# EAGLE design res15_nrf905 (EAGLE 7.2.0)
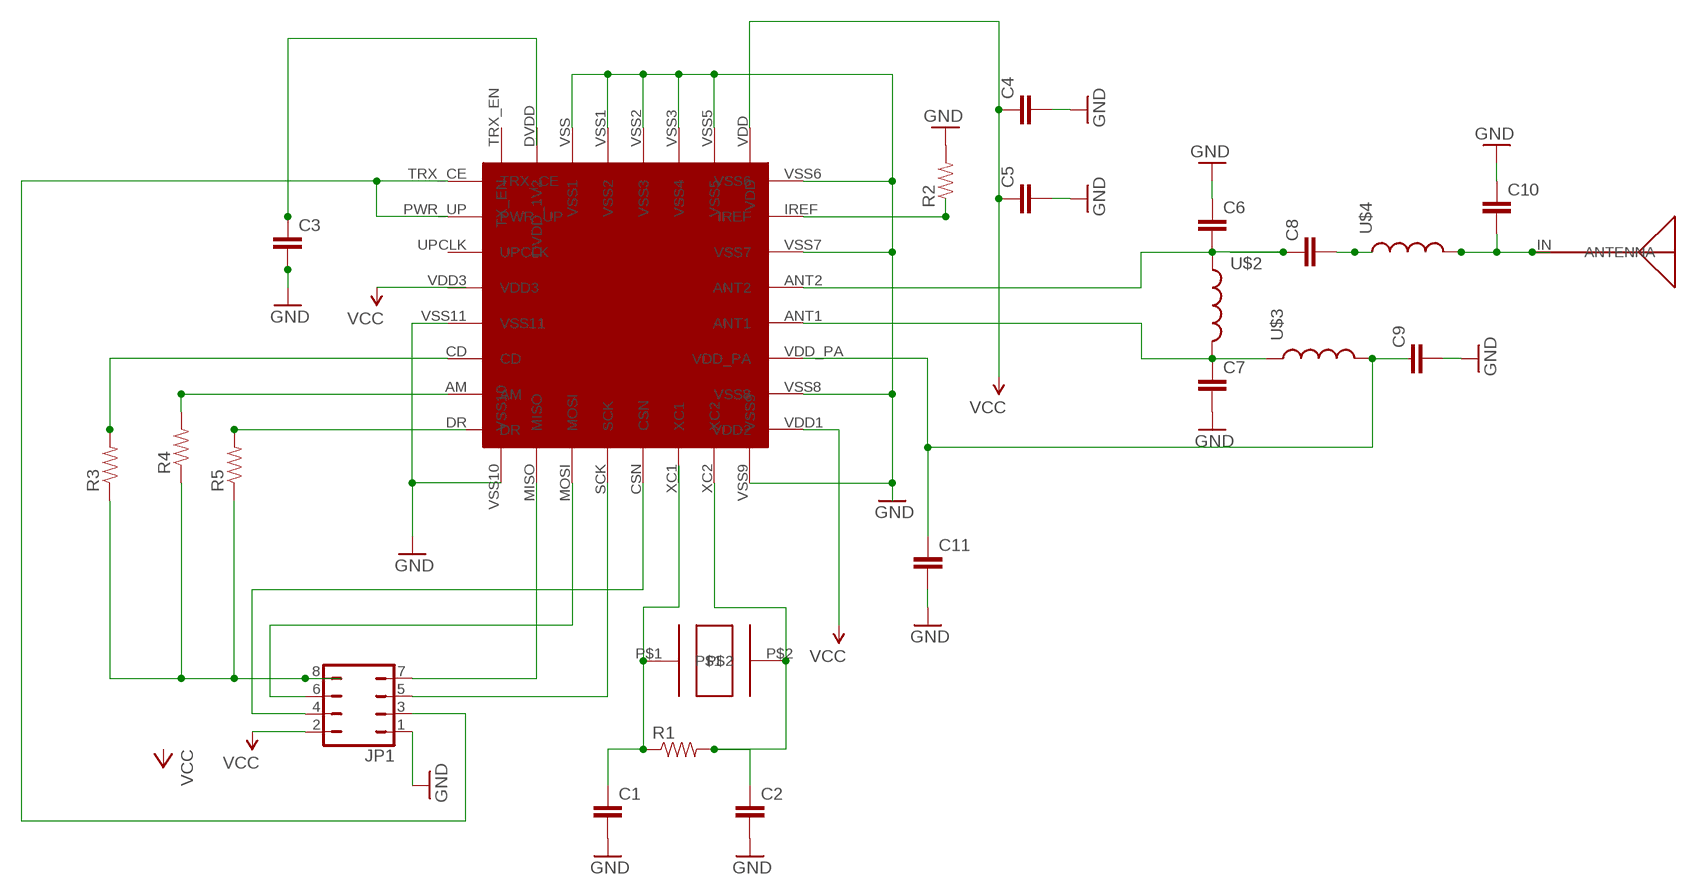
[diagram p0: schematic, sheet 1]

## Parts
C1  CAP0402-CAP  [0402-CAP]
C2  CAP0402-CAP  [0402-CAP]
C3  CAP0402-CAP  [0402-CAP]
C4  CAP0402-CAP  [0402-CAP]
C5  CAP0402-CAP  [0402-CAP]
C6  CAP0402-CAP  [0402-CAP]
C7  CAP0402-CAP  [0402-CAP]
C8  CAP0402-CAP  [0402-CAP]
C9  CAP0402-CAP  [0402-CAP]
C10  CAP0402-CAP  [0402-CAP]
C11  CAP0402-CAP  [0402-CAP]
JP1  JP4Q  [JP4Q]
R1  RESISTOR0402-RES  [0402-RES]
R2  RESISTOR0603-RES  [0603-RES]
R3  RESISTOR0603-RES  [0603-RES]
R4  RESISTOR0603-RES  [0603-RES]
R5  RESISTOR0603-RES  [0603-RES]
U$1  NRF905  [NRF905]
U$2  INDUCTOR0603  [0603]
U$3  INDUCTOR0603  [0603]
U$4  INDUCTOR0603  [0603]
U$5  WURTH-7488910092  [WURTH-7488910092]
U$6  HC46X  [HC46X]

## Nets
GND: C1.2 C2.2 C3.2 C4.2 C5.2 C6.1 C7.2 C9.2 C10.1 C11.2 JP1.1 R2.2 U$1.VSS1(VSS2) U$1.VSS2(VSS3) U$1.VSS3(VSS4) U$1.VSS5 U$1.VSS6 U$1.VSS7 U$1.VSS8 U$1.VSS9 U$1.VSS10 U$1.VSS11 U$1.VSS(VSS1)
N$1: C1.1 R1.1 U$6.P$1
N$2: C2.1 R1.2 U$1.XC2 U$6.P$2
N$3: C7.1 U$1.ANT1 U$2.2 U$3.1
N$4: JP1.7 U$1.MISO
N$5: JP1.6 U$1.MOSI
N$6: C3.1
N$7: JP1.5 U$1.SCK
N$9: C11.1 U$1.VDD_PA U$3.2
N$10: C6.2 C8.1 U$1.ANT2 U$2.1
N$11: C8.2 U$4.1
N$12: C10.2 U$4.2 U$5.IN(ANTENNA)
N$13: JP1.4 U$1.CSN
N$14: R2.1 U$1.IREF
N$15: JP1.3 U$1.PWR_UP U$1.TRX_CE
N$16: R3.2 U$1.CD
N$17: JP1.8 R3.1 R4.1 R5.1
N$18: R4.2 U$1.AM
N$19: R5.2
VCC: C4.1 C5.1 JP1.2 U$1.VDD U$1.VDD1(VDD2)
Unconnected: C9.1 U$1.DVDD(DVDD_1V2) U$1.TRX_EN(TX_EN) U$1.UPCLK U$1.XC1

## Power pins joined to a net without a drawn wire
DR: U$1.DR
VDD3: U$1.VDD3

## Library data of the parts
C1-C11 = SparkFun:CAP: Capacitor Standard 0603 ceramic capacitor, and 0.1" leaded capacitor.
JP1 = jumper:JP4Q: JUMPER
R1-R5 = SparkFun:RESISTOR: Resistor Basic schematic elements and footprints for 0603, 1206, and PTH 1/10th watt (small) resistors.
U$1 = nrf905:NRF905
U$2-U$4 = SparkFun:INDUCTOR: Inductors Basic Inductor/Choke - 0603 and 1206. Footprints are not proven and vary greatly between part numbers.
U$5 = nrf905:WURTH-7488910092
U$6 = nrf905:HC46X

## Board
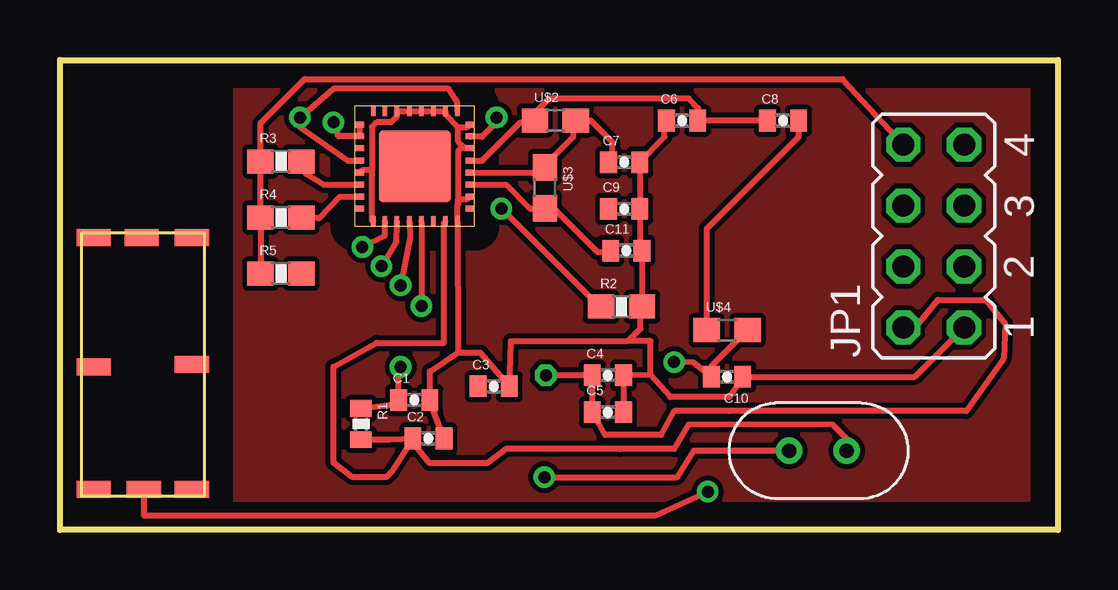
[diagram p1: board, top side]
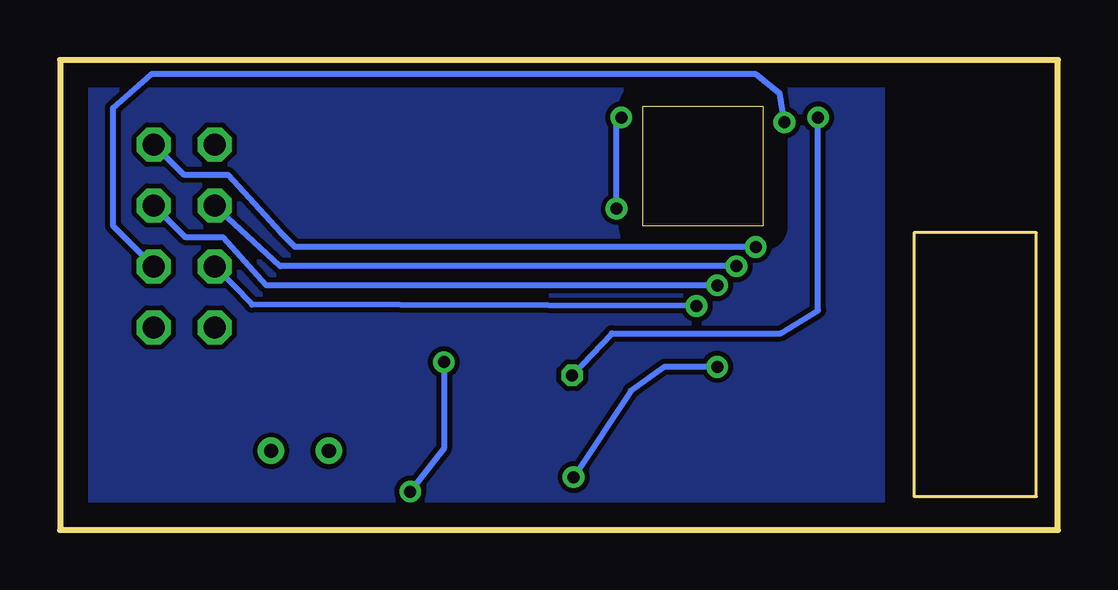
[diagram p2: board, bottom side, seen from below]

Size 41.6 x 19.6 mm. Coordinates in mm from the lower left corner, seen from the top.
Outline: 0,19.6 41.6,19.6 41.6,0 0,0 0,19.6
Copper layers (1*16): Top 0.035mm / dielectric 1.5mm / Bottom 0.035mm
Design rules "default": minimum track width 10mil, minimum drill 24mil, track to track 8mil, track to pad 8mil, pad to pad 8mil, via to via 8mil, smd to smd 8mil, copper to edge 40mil, drill to drill 8mil, minimum pad ring 10mil, minimum via ring 8mil, stop-mask expansion 4mil, vias tented up to drill 0mil, thermal gap 10mil
tKeepout: area 0,0 to 7.2,19.6
tRestrict: area 0,0 to 7.2,19.6
bRestrict: area 0,0 to 7.2,19.6

### Footprints (pad centres in the part's own frame; a part is rotated, then mirrored left to right if it is on the bottom)
0402-CAP = smd 0.7 x 0.9: 1 -0.65,0; 2 0.65,0
JP4Q = drill 0.914 octagon: 1 -3.81,-1.27; 2 -3.81,1.27; 3 -1.27,-1.27; 4 -1.27,1.27; 5 1.27,-1.27; 6 1.27,1.27; 7 3.81,-1.27; 8 3.81,1.27
0402-RES = smd 0.7 x 0.9: 1 -0.65,0; 2 0.65,0
0603-RES = smd 1.1 x 1: 1 -0.85,0; 2 0.85,0
NRF905 = smd 0.406 x 0.23: AM 0.2,-3.775; ANT1 4.8,-2.775; ANT2 4.8,-2.275; CD 0.2,-3.275; DR 0.2,-4.275; IREF 4.8,-1.25; PWR_UP 0.2,-1.25; TRX_CE 0.2,-0.775; UPCLK 0.2,-1.75; VDD 0.2,-2.275; VDD3 4.8,-4.275; VDD_PA 4.8,-3.275; VSS 0.2,-2.775; VSS7 4.8,-0.775; VSS8 4.8,-1.75; VSS9 4.8,-3.775 | smd 0.23 x 0.406: CSN 2.775,-4.8; DVDD 1.25,-0.2; MISO 1.25,-4.8; MOSI 1.75,-4.8; SCK 2.275,-4.8; TRX_EN 0.775,-0.2; VDD1 4.275,-0.2; VSS1 1.75,-0.2; VSS2 2.275,-0.2; VSS3 2.775,-0.2; VSS5 3.275,-0.2; VSS6 3.775,-0.2; VSS10 4.275,-4.8; VSS11 0.775,-4.8; XC1 3.275,-4.8; XC2 3.775,-4.8 | smd 3 x 3: P$33 2.5,-2.5
0603 = smd 1.1 x 1: 1 -0.85,0; 2 0.85,0
WURTH-7488910092 = smd 0.711 x 1.422: IN 10.7,-2.5; NC 10.7,-0.5; NC2 10.7,-4.6; NC3 5.6,-4.6; NC4 5.5,-0.5; NC5 0.2,-0.5; NC6 0.2,-2.6; NC7 0.2,-4.6
HC46X = drill 0.6: P$1 2.4,-0.3; P$2 0,-0.3

### Placement (x,y rotation side)
C1  14.77,5.42 0 top
C2  15.36,3.82 0 top
C3  18.08,5.99 0 top
C4  22.84,6.45 0 top
C5  22.84,4.91 0 top
C6  25.93,17.07 0 top
C7  23.52,15.33 0 top
C8  30.14,17.07 0 top
C9  23.52,13.39 0 top
C10  27.81,6.39 180 top
C11  23.61,11.65 0 top
JP1  36.42,12.26 90 top
R1  12.55,4.42 270 top
R2  23.41,9.31 0 top
R3  9.21,15.37 0 top
R4  9.21,13.03 0 top
R5  9.21,10.69 0 top
U$1  12.29,17.67 0 top
U$2  20.65,17.07 0 top
U$3  20.21,14.27 270 top
U$4  27.81,8.33 0 top
U$5  6,12.4 270 top
U$6  32.8,3 180 top

### Tracks (layer width: path | path; a pad name or v marks a point on that pad's centre or on a via)
GND
  Top 0.254: C2.2 C1.2 15.42,6.62 16.6,7.4 | 16.6,7.4 17.52,7.4 C3.2 18.8,7.79 18.8,7.88 23.64,7.88 | C5.2 C4.2 24.62,6.46 | 16.6,7.4 16.56,12.83 U$1.VSS10 16.56,13.56 16.6,13.6 16.6,13.8 | C6.1 25.2,16.99 25.2,16.4 24.17,15.37 C7.2 C9.2 24.17,11.74 C11.2 R2.2 24.2,9.25 24.2,8.4 23.79,7.99 23.64,7.88 | 16.6,13.8 16.99,13.8 U$1.VSS9 | 16.6,16.8 16.6,16.2 16.88,15.92 U$1.VSS8 16.72,15.92 16.6,15.8 16.6,13.8 | 16.6,16.8 16.99,16.8 U$1.VSS7 | 16.6,16.8 16.06,17.34 U$1.VSS6 U$1.VSS5 U$1.VSS3 U$1.VSS2 U$1.VSS1 14.04,17.24 13.8,17 13.2,17 13,16.8 13,15 | 13,15 12.6,15 U$1.VSS | U$1.VSS11 13.02,12.87 13.02,12.92 13.02,14.8 13,15 | JP1.1 35.63,6.39 C10.1 27.9,5.54 25.44,5.54 24.62,6.46 | 24.62,6.46 24.62,7.87 23.64,7.88
N$1  (via drill 0.5)
  Top 0.254: R1.1 14.17,5.27 C1.1 14.12,6.72 v14.2,6.8 | v20.19,2.2 25.71,2.2 26.41,3.3 U$6.P$1
  Bottom 0.254: v14.2,6.8 16.4,6.8 17.8,5.8 v20.19,2.2
N$2
  Top 0.254: R1.2 13.76,3.77 C2.1 | C2.1 14.67,3.72 15.41,2.78 17.8,2.78 18.6,3.38 23.34,3.38 25.6,3.38 26.2,4.4 32.21,4.39 32.8,3.8 U$6.P$2 | C2.1 13.82,2.42 13.6,2.2 12.2,2.2 11.4,2.8 11.4,6.8 13.2,7.8 16,7.8 16,12.81 U$1.XC2
N$3
  Top 0.254: C7.1 23,15.46 23,16.2 22.13,17.07 U$2.2 21.4,16.97 21.4,16.4 20.21,15.21 U$3.1 19.98,14.9 U$1.ANT1
N$4  (via drill 0.5)
  Top 0.254: U$1.MISO 13.54,12.26 v12.6,11.8
  Bottom 0.254: v12.6,11.8 31.8,11.8 32.4,12.4 34.6,14.8 36.42,14.8 JP1.7
N$5  (via drill 0.5)
  Top 0.254: U$1.MOSI 14.04,12.76 14,12 v13.4,11
  Bottom 0.254: v13.4,11 32.42,11 JP1.6
N$7  (via drill 0.5)
  Top 0.254: U$1.SCK 14.56,12.83 14.6,12.2 v14.2,10.2
  Bottom 0.254: v14.2,10.2 33,10.2 34.8,12.2 36.36,12.2 JP1.5
N$8
  pour Bottom: 0,19.6 41.6,19.6 41.6,0 0,0
N$9
  Top 0.254: U$1.VDD_PA 18.6,14.4 19.6,13.4 20.19,13.4 U$3.2 20.58,13.42 22.4,11.6 22.91,11.6 C11.1
N$10
  Top 0.254: C8.1 C6.2 26.6,17.09 26.6,17.6 26.2,18 20.4,18 19.8,17.4 U$2.1 19.73,17 19.2,17 17.59,15.4 U$1.ANT2
N$11
  Top 0.254: U$4.1 26.96,12.56 30.8,16.4 C8.2
N$12  (via drill 0.5)
  Top 0.254: U$4.2 27.16,6.83 C10.2 26.4,6.99 v25.6,7 | v27,1.6 24.8,0.6 3.5,0.6 U$5.IN
  Bottom 0.254: v25.6,7 25.6,3.4 v27,1.6
N$13  (via drill 0.5)
  Top 0.254: U$1.CSN v15.06,9.33
  Bottom 0.254: v15.06,9.33 33.6,9.4 JP1.4
N$14  (via drill 0.5)
  Top 0.254: R2.1 22.49,9.31 v18.4,13.4 | v18.2,17.2 18.2,17 17.6,16.4 17.11,16.4 U$1.IREF
  Bottom 0.254: v18.4,13.4 18.4,17 v18.2,17.2
N$15  (via drill 0.5)
  Top 0.254: U$1.TRX_CE U$1.PWR_UP 11.62,16.42 v11.4,17
  Bottom 0.254: v11.4,17 11.6,18.2 12.6,19 37.8,19 39.4,17.6 39.4,12.7 JP1.3
N$16
  Top 0.254: R3.2 10.26,14.86 11,14.4 U$1.CD
N$17
  Top 0.254: R5.1 R4.1 R3.1 8.36,16.96 10.2,18.8 32.62,18.8 JP1.8
N$18
  Top 0.254: R4.2 10.83,13.03 10.8,13 11.67,13.9 U$1.AM
N$20
  pour Top: 0,19.6 41.6,19.6 41.6,0 0,0
VCC  (via drill 0.5)
  Top 0.254: JP1.2 35.65,8.45 36.6,9.6 38.6,9.6 39.4,8.6 39.34,7.16 37.78,4.96 27.9,4.95 25.6,4.95 25.06,3.96 22.73,3.96 22.7,4 C5.1 C4.1 v20.25,6.45 | U$1.VDD1 16.56,17.84 16.2,18.4 11.4,18.4 v10,17.2 10,16.8 12,15.4 U$1.VDD
  Bottom 0.254: v20.25,6.45 18.6,8.2 11.56,8.2 10,9.16 v10,17.2